# Altium schematic sheet Sheet1.SchDoc
size A; SheetNumber: 1; SheetTotal: 1
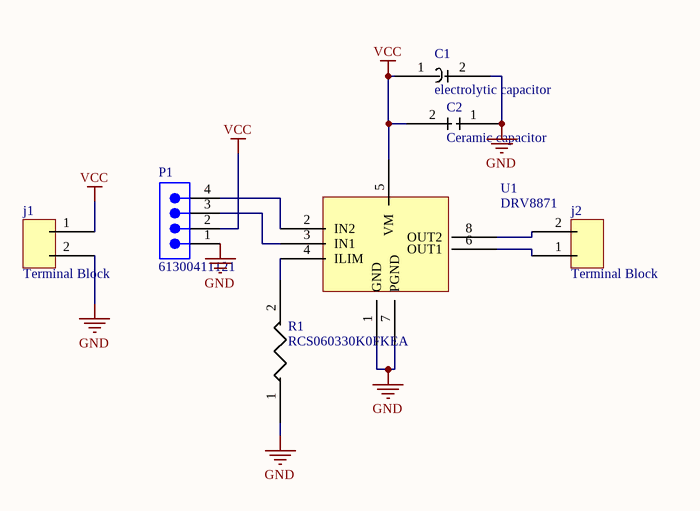
[diagram p0: Sheet1.SchDoc]

## Parts
C1  electrolytic capacitor  [electrolytic capacitor]
C2  Ceramic capacitor  [ceramic capacitor]
j1  Terminal Block  [Terminal block]
j2  Terminal Block  [Terminal block]
P1  61300411121  [61300411121]
R1  RCS060330K0FKEA  [RCS060330K0FKEA]
U1  DRV8871  [DRV8871]

## Nets
GND: C1.2 C2.1 j1.2 P1.1 R1.1 U1.1(GND) U1.7(PGND)
VCC: C1.1 C2.2 j1.1 P1.2 U1.5(VM)
Netj2_1: j2.1 U1.6(OUT1)
Netj2_2: j2.2 U1.8(OUT2)
NetP1_3: P1.3 U1.3(IN1)
NetP1_4: P1.4 U1.2(IN2)
NetR1_2: R1.2 U1.4(ILIM)

## Library data of the parts
C1 = electrolytic capacitor: part number: 732-8416-2-ND; manf part number: 865080342006; manf: Würth Elektronik; supplier: digikey
C2 = Ceramic capacitor: part number: 1276-1002-2-ND; manf part number: CL05B104KP5NNNC; manf: Samsung Electro-Mechanics; supplier: digikey
j1 j2 = Terminal Block: Part number: 300000007278; Supplier: Makers
P1 = CMP-1502-01064-3: NexarPartId: 32855522; Operating Supply Voltage: 250V; Pitch: 2.54mm; Contact Resistance: 20mΩ; Number of Positions: 4; Current Rating: 3A; Connector Type: Male Pin; Gender: Male; Contact Plating: Gold; Height: 8.89mm; Lead Pitch: 2.54mm; Lead Free: Lead Free; Contact Mating Length: 5.9944mm; Number of Rows: 1; Termination: Solder; Packaging: Bulk; REACH SVHC: Unknown; Min Operating Temperature: -40°C; RoHS: Compliant; Number of Contacts: 4; Voltage Rating: 250V; Color: Black; Max Operating Temperature: 105°C; Contact Material: Copper; Mount: Through Hole; Orientation: Vertical; Number of Pins: 4
R1 = RCS060330K0FKEA: part number: 541-10453-2-ND; manf: Vishay Dale; supplier: digikey; manf part number: RCS060330K0FKEA
U1 = DRV8871: PART NUMBER: 296-43024-2-ND; MANFACTURER PART NUMBER: DRV8871DDAR; MANFACTURER: Texas Instruments; SUPPLIER: digikey